# EasyEDA schematic SCH_esp-firework-firing-system-hw1.json
TITLE: Sheet_1; REV: 1.0; Date: 2023-05-22; Sheet: 1/1; Company: Your Company
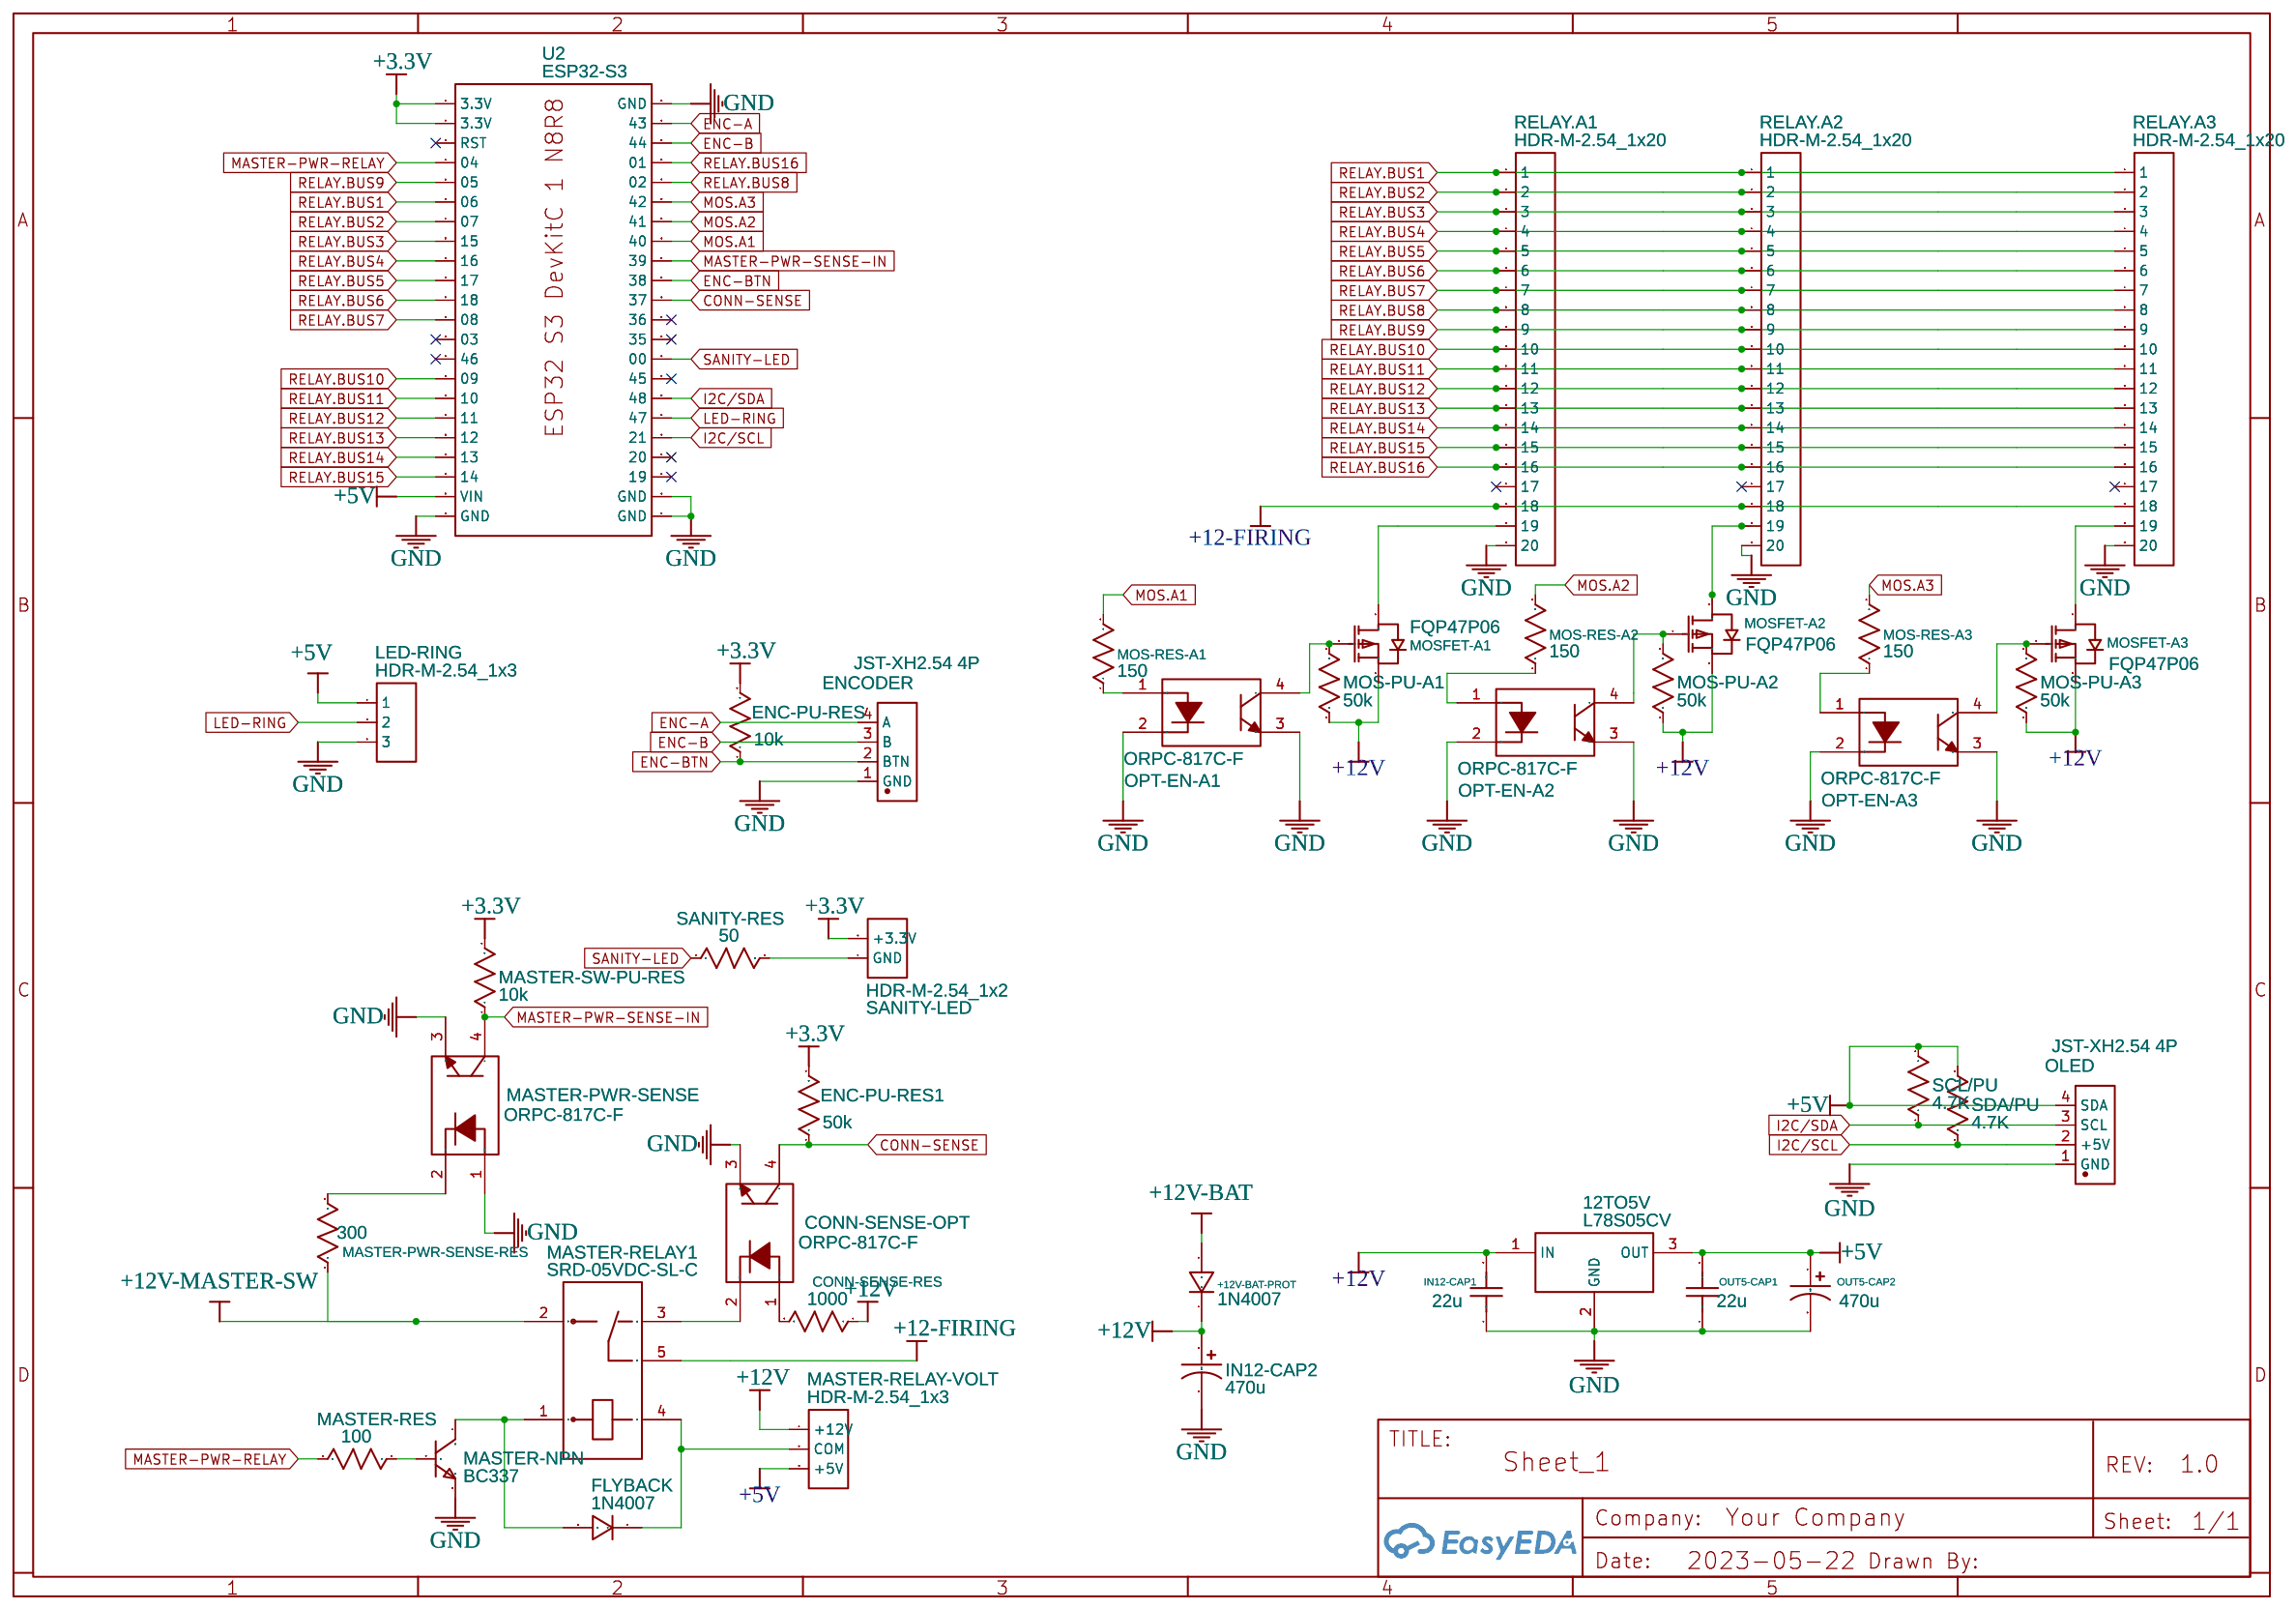
[diagram p0: schematic sheet]

## Parts
12TO5V  L78S05CV  [TO-220-3_L10.0-W4.5-P2.54-L]
+12V-BAT-PROT  1N4007  [DO-41_BD2.4-L4.7-P8.70-D0.9-RD]
CONN-SENSE-OPT  ORPC-817C-F  [DIP-4_L4.6-W6.5-P2.54-LS7.6-BR]
CONN-SENSE-RES  1000  [R_AXIAL-0.3]
ENC-PU-RES  10k  [R_AXIAL-0.3]
ENC-PU-RES1  50k  [R_AXIAL-0.3]
ENCODER  JST-XH2.54 4P  [JST-XH2.54 4P]
FLYBACK  1N4007  [DO-41_BD2.4-L4.7-P8.70-D0.9-RD]
IN12-CAP1  22u  [RAD-0.1]
IN12-CAP2  470u  [CAP-D6.3×F2.5]
LED-RING  HDR-M-2.54_1x3  [HDR-M-2.54_1X3]
MASTER-NPN  BC337  [BC337]
MASTER-PWR-SENSE  ORPC-817C-F  [DIP-4_L4.6-W6.5-P2.54-LS7.6-BR]
MASTER-PWR-SENSE-RES  300  [R_AXIAL-0.3]
MASTER-RELAY1  SRD-05VDC-SL-C  [RELAY-TH_SRD-XXVDC-XL-C]
MASTER-RELAY-VOLT  HDR-M-2.54_1x3  [HDR-M-2.54_1X3]
MASTER-RES  100  [R_AXIAL-0.3]
MASTER-SW-PU-RES  10k  [R_AXIAL-0.3]
MOS-PU-A1  50k  [R_AXIAL-0.3]
MOS-PU-A2  50k  [R_AXIAL-0.3]
MOS-PU-A3  50k  [R_AXIAL-0.3]
MOS-RES-A1  150  [R_AXIAL-0.3]
MOS-RES-A2  150  [R_AXIAL-0.3]
MOS-RES-A3  150  [R_AXIAL-0.3]
MOSFET-A1  FQP47P06  [TO-220F-3_L10.2-W4.9-P2.54-L]
MOSFET-A2  FQP47P06  [TO-220F-3_L10.2-W4.9-P2.54-L]
MOSFET-A3  FQP47P06  [TO-220F-3_L10.2-W4.9-P2.54-L]
OLED  JST-XH2.54 4P  [JST-XH2.54 4P]
OPT-EN-A1  ORPC-817C-F  [DIP-4_L4.6-W6.5-P2.54-LS7.6-BR]
OPT-EN-A2  ORPC-817C-F  [DIP-4_L4.6-W6.5-P2.54-LS7.6-BR]
OPT-EN-A3  ORPC-817C-F  [DIP-4_L4.6-W6.5-P2.54-LS7.6-BR]
OUT5-CAP1  22u  [RAD-0.1]
OUT5-CAP2  470u  [CAP-D6.3×F2.5]
RELAY.A1  HDR-M-2.54_1x20  [HDR-M-2.54_1X20]
RELAY.A2  HDR-M-2.54_1x20  [HDR-M-2.54_1X20]
RELAY.A3  HDR-M-2.54_1x20  [HDR-M-2.54_1X20]
SANITY-LED  HDR-M-2.54_1x2  [HDR-M-2.54_1X2]
SANITY-RES  50  [R_AXIAL-0.3]
SCL/PU  4.7K  [R_AXIAL-0.3]
SDA/PU  4.7K  [R_AXIAL-0.3]
U2  ESP32-S3  [ESP32-S3-DEVKITC-1-N8R8]

## Library data of the parts
12TO5V = L78S05CV: Supplier: LCSC; Manufacturer: ST(意法半导体); Supplier Part: C33043; JLCPCB Part Class: Extended Part
+12V-BAT-PROT FLYBACK = 1N4007: Supplier: LCSC; Manufacturer: SEMTECH; Supplier Part: C106903; Contributor: LCEDA_Lib
CONN-SENSE-OPT MASTER-PWR-SENSE OPT-EN-A1-OPT-EN-A3 = ORPC-817C-F: Supplier: LCSC; Supplier Part: C2842770; Manufacturer: Orient(奥伦德); Contributor: LCSC; JLCPCB Part Class: Extended Part
CONN-SENSE-RES ENC-PU-RES ENC-PU-RES1 MASTER-PWR-SENSE-RES MASTER-RES MASTER-SW-PU-RES MOS-PU-A1-MOS-PU-A3 MOS-RES-A1-MOS-RES-A3 SANITY-RES SCL/PU SDA/PU = R_AXIAL-0.3_US: Contributor: LCEDA_Lib
ENCODER OLED = JST-XH2.54 4P: Supplier: CQRobot; link: https://www.amazon.fr/dp/B01EQGNZ2I/?coliid=IQPWZUUK7M1P0&colid=2CFFEVMK4YZ12&ref_=lv_ov_lig_dp_it_im&th=1; Contributor: marierigal4
IN12-CAP1 OUT5-CAP1 = C_RAD-0.1_US: Contributor: LCEDA_Lib
IN12-CAP2 OUT5-CAP2 = CE_TH_D6.3×F2.5_US: Contributor: LCEDA_Lib
LED-RING MASTER-RELAY-VOLT = HDR-M-2.54_1x3: Supplier Part: C180248; Supplier: LCSC; Contributor: LCEDA_Lib
MASTER-NPN = BC337: Contributor: HTDvN
MASTER-RELAY1 = SRD-05VDC-SL-C: Supplier: LCSC; Manufacturer: 松乐; Supplier Part: C35449; JLCPCB Part Class: Extended Part
MOSFET-A1-MOSFET-A3 = FQP47P06: Supplier: LCSC; Supplier Part: C462765; Manufacturer: onsemi(安森美); Contributor: LCSC; JLCPCB Part Class: Extended Part
RELAY.A1-RELAY.A3 = HDR-M-2.54_1x20: Supplier Part: C50981; Supplier: LCSC; Contributor: LCEDA_Lib
SANITY-LED = HDR-M-2.54_1x2: Supplier Part: C124375; Supplier: LCSC; Contributor: LCEDA_Lib
U2 = ESP32-S3: Contributor: moreauf

## Nets
+3.3V: ENC-PU-RES.2 ENC-PU-RES1.2 MASTER-SW-PU-RES.2 SANITY-LED.2(+3.3V) U2.1(3.3V) U2.2(3.3V)
+5V: 12TO5V.3(OUT) LED-RING.1 MASTER-RELAY-VOLT.3(+5V) OLED.4(SDA) OUT5-CAP1.2 OUT5-CAP2.1 SCL/PU.2 SDA/PU.2 U2.21(VIN)
+12V: 12TO5V.1(IN) +12V-BAT-PROT.1 CONN-SENSE-RES.1 IN12-CAP1.2 IN12-CAP2.1 MASTER-RELAY-VOLT.1(+12V) MOS-PU-A1.1 MOS-PU-A2.1 MOS-PU-A3.1 MOSFET-A1.3(S) MOSFET-A2.3(S) MOSFET-A3.3(S)
+12V-BAT: +12V-BAT-PROT.2
+12V-MASTER-SW: MASTER-PWR-SENSE-RES.1 MASTER-RELAY1.2
GND: 12TO5V.2(GND) CONN-SENSE-OPT.3 ENCODER.1(GND) IN12-CAP1.1 IN12-CAP2.2 LED-RING.3 MASTER-NPN.3(E) MASTER-PWR-SENSE.1 MASTER-PWR-SENSE.3 OLED.1(GND) OPT-EN-A1.2 OPT-EN-A1.3 OPT-EN-A2.2 OPT-EN-A2.3 OPT-EN-A3.2 OPT-EN-A3.3 OUT5-CAP1.1 OUT5-CAP2.2 RELAY.A1.20 RELAY.A2.20 RELAY.A3.20 U2.22(GND) U2.23(GND) U2.43(GND) U2.44(GND)
+12-FIRING: MASTER-RELAY1.5 RELAY.A1.18 RELAY.A2.18 RELAY.A3.18
CONN-SENSE: CONN-SENSE-OPT.4 ENC-PU-RES1.1 U2.33(37)
ENC-A: ENCODER.4(A) U2.24(43)
ENC-B: ENCODER.3(B) U2.25(44)
ENC-BTN: ENC-PU-RES.1 ENCODER.2(BTN) U2.32(38)
I2C/SCL: OLED.2(+5V) SDA/PU.1 U2.40(21)
I2C/SDA: OLED.3(SCL) SCL/PU.1 U2.38(48)
LED-RING: LED-RING.2 U2.39(47)
MASTER-PWR-RELAY: MASTER-RES.2 U2.4(04)
MASTER-PWR-SENSE-IN: MASTER-PWR-SENSE.4 MASTER-SW-PU-RES.1 U2.31(39)
MOS.A1: MOS-RES-A1.2 U2.30(40)
MOS.A2: MOS-RES-A2.2 U2.29(41)
MOS.A3: MOS-RES-A3.2 U2.28(42)
RELAY.BUS1: RELAY.A1.1 RELAY.A2.1 RELAY.A3.1 U2.6(06)
RELAY.BUS2: RELAY.A1.2 RELAY.A2.2 RELAY.A3.2 U2.7(07)
RELAY.BUS3: RELAY.A1.3 RELAY.A2.3 RELAY.A3.3 U2.8(15)
RELAY.BUS4: RELAY.A1.4 RELAY.A2.4 RELAY.A3.4 U2.9(16)
RELAY.BUS5: RELAY.A1.5 RELAY.A2.5 RELAY.A3.5 U2.10(17)
RELAY.BUS6: RELAY.A1.6 RELAY.A2.6 RELAY.A3.6 U2.11(18)
RELAY.BUS7: RELAY.A1.7 RELAY.A2.7 RELAY.A3.7 U2.12(08)
RELAY.BUS8: RELAY.A1.8 RELAY.A2.8 RELAY.A3.8 U2.27(02)
RELAY.BUS9: RELAY.A1.9 RELAY.A2.9 RELAY.A3.9 U2.5(05)
RELAY.BUS10: RELAY.A1.10 RELAY.A2.10 RELAY.A3.10 U2.15(09)
RELAY.BUS11: RELAY.A1.11 RELAY.A2.11 RELAY.A3.11 U2.16(10)
RELAY.BUS12: RELAY.A1.12 RELAY.A2.12 RELAY.A3.12 U2.17(11)
RELAY.BUS13: RELAY.A1.13 RELAY.A2.13 RELAY.A3.13 U2.18(12)
RELAY.BUS14: RELAY.A1.14 RELAY.A2.14 RELAY.A3.14 U2.19(13)
RELAY.BUS15: RELAY.A1.15 RELAY.A2.15 RELAY.A3.15 U2.20(14)
RELAY.BUS16: RELAY.A1.16 RELAY.A2.16 RELAY.A3.16 U2.26(01)
SANITY-LED: SANITY-RES.1 U2.36(00)
Net-(CONN-SENSE-OPT-1): CONN-SENSE-OPT.1 CONN-SENSE-RES.2
Net-(CONN-SENSE-OPT-2): CONN-SENSE-OPT.2 MASTER-RELAY1.3
Net-(FLYBACK-1): FLYBACK.1 MASTER-RELAY1.4 MASTER-RELAY-VOLT.2(COM)
Net-(FLYBACK-2): FLYBACK.2 MASTER-NPN.1(C) MASTER-RELAY1.1
Net-(MASTER-NPN-2): MASTER-NPN.2(B) MASTER-RES.1
Net-(MASTER-PWR-SENSE-2): MASTER-PWR-SENSE.2 MASTER-PWR-SENSE-RES.2
Net-(MOS-PU-A1-2): MOS-PU-A1.2 MOSFET-A1.1(G) OPT-EN-A1.4
Net-(MOS-PU-A2-2): MOS-PU-A2.2 MOSFET-A2.1(G) OPT-EN-A2.4
Net-(MOS-PU-A3-2): MOS-PU-A3.2 MOSFET-A3.1(G) OPT-EN-A3.4
Net-(MOS-RES-A1-1): MOS-RES-A1.1 OPT-EN-A1.1
Net-(MOS-RES-A2-1): MOS-RES-A2.1 OPT-EN-A2.1
Net-(MOS-RES-A3-1): MOS-RES-A3.1 OPT-EN-A3.1
Net-(MOSFET-A1-2): MOSFET-A1.2(D) RELAY.A1.19
Net-(MOSFET-A2-2): MOSFET-A2.2(D) RELAY.A2.19
Net-(MOSFET-A3-2): MOSFET-A3.2(D) RELAY.A3.19
Net-(SANITY-LED-1): SANITY-LED.1(GND) SANITY-RES.2

Not connected (* = marked no-connect by the designer): RELAY.A1 17*; RELAY.A2 17*; RELAY.A3 17*; U2 3(RST)* 13(03)* 14(46)* 34(36)* 35* 37(45)* 41(20)* 42(19)*
